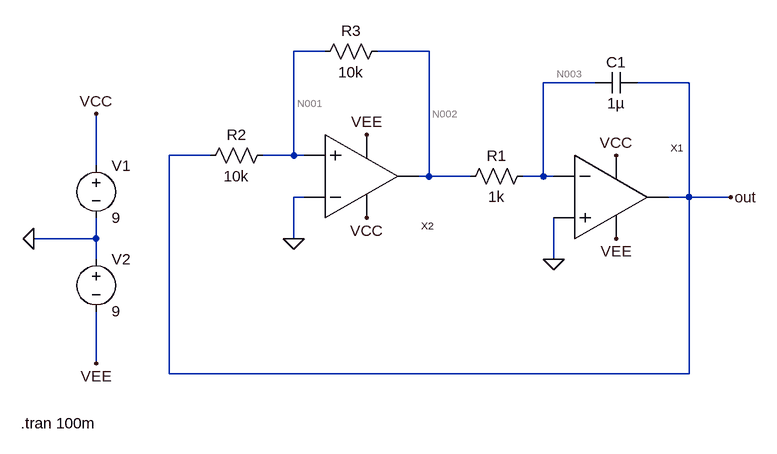
[diagram p0: schematic Perc-5-SawTooth.asc]
Perc-5-SawTooth.asc, the LTspice schematic file:
Version 4
SHEET 1 880 840
WIRE 48 160 0 160
WIRE 208 160 128 160
WIRE 464 208 384 208
WIRE 608 208 528 208
WIRE -128 320 -192 320
WIRE 0 320 0 160
WIRE 0 320 -48 320
WIRE 16 320 0 320
WIRE -304 336 -304 256
WIRE 208 352 208 160
WIRE 208 352 192 352
WIRE 272 352 208 352
WIRE 384 352 384 208
WIRE 384 352 352 352
WIRE 400 352 384 352
WIRE 16 384 0 384
WIRE 608 384 608 208
WIRE 608 384 576 384
WIRE 672 384 608 384
WIRE -304 448 -304 416
WIRE -304 448 -400 448
WIRE 0 448 0 384
WIRE -304 480 -304 448
WIRE 400 480 400 416
WIRE -304 640 -304 560
WIRE -192 656 -192 320
WIRE 608 656 608 384
WIRE 608 656 -192 656
FLAG -304 256 VCC
FLAG -304 640 VEE
FLAG -400 448 0
FLAG 112 288 VEE
FLAG 496 448 VEE
FLAG 112 416 VCC
FLAG 496 320 VCC
FLAG 672 384 out
FLAG 400 480 0
FLAG 0 448 0
SYMBOL voltage -304 320 R0
SYMATTR InstName V1
SYMATTR Value 9
SYMBOL voltage -304 464 R0
SYMATTR InstName V2
SYMATTR Value 9
SYMBOL Opampku 480 384 R0
SYMATTR InstName X1
SYMBOL Opampku 96 352 M180
SYMATTR InstName X2
SYMBOL res 368 336 R90
WINDOW 0 0 56 VBottom 2
WINDOW 3 32 56 VTop 2
SYMATTR InstName R1
SYMATTR Value 1k
SYMBOL res -32 304 R90
WINDOW 0 0 56 VBottom 2
WINDOW 3 32 56 VTop 2
SYMATTR InstName R2
SYMATTR Value 10k
SYMBOL res 144 144 R90
WINDOW 0 0 56 VBottom 2
WINDOW 3 32 56 VTop 2
SYMATTR InstName R3
SYMATTR Value 10k
SYMBOL cap 528 192 R90
WINDOW 0 0 32 VBottom 2
WINDOW 3 32 32 VTop 2
SYMATTR InstName C1
SYMATTR Value 1µ
TEXT -420 732 Left 2 !.tran 100m

The netlist it stands for:
* Perc-5-SawTooth.asc
V1 VCC 0 9
V2 0 VEE 9
XX1 N003 0 VCC VEE out Opampku  ; pins inn inp vp vn out
XX2 0 N001 VCC VEE N002 Opampku  ; pins inn inp vp vn out
R1 N003 N002 1k
R2 N001 out 10k
R3 N002 N001 10k
C1 out N003 1µ
.tran 100m
.backanno
.end

* Results of the author's LTspice run, read from the files saved beside the schematic
* Operating Point, zero values left out:
*   V(vcc) = 9 V
*   V(vee) = -9 V
*   V(out) = 659.8 µV
*   V(n003) = 19.25 µV
*   V(n002) = 99.02 µV
*   V(n001) = -19.25 µV
*   I(R3) = 11.83 nA
*   I(R2) = -67.9 nA
*   I(R1) = -79.77 nA
*   I(V2) = -2.013 mA
*   I(V1) = -2.012 mA
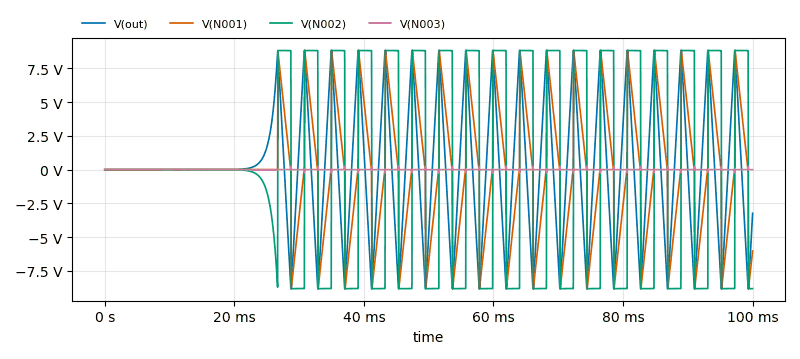
[diagram p1: Transient Analysis of Perc-5-SawTooth.asc, plotted from the saved traces]
* Transient Analysis, 1 run:
*   V(out): min -8.821 V, max 8.821 V, average 46.67 mV, rms 6.769 V, last -3.231 V
*   V(N001): min -8.816 V, max 8.815 V, average 39.07 mV, rms 5.056 V, last -6.02 V
*   V(N002): min -8.81 V, max 8.81 V, average 32.29 mV, rms 7.523 V, last -8.81 V
*   V(N003): min -245.9 mV, max 239 mV, average 56.98 µV, rms 26.9 mV, last -1.378 mV